# EasyEDA schematic SuperCapacitor2.0_2020-03-19_00-01-51.json

## Sheets
1 Switch1 copy: TITLE: SC8701; REV: 1.0; Date: 2020-02-22; Sheet: 1/1; Drawn By: Bard; Company: Your Company
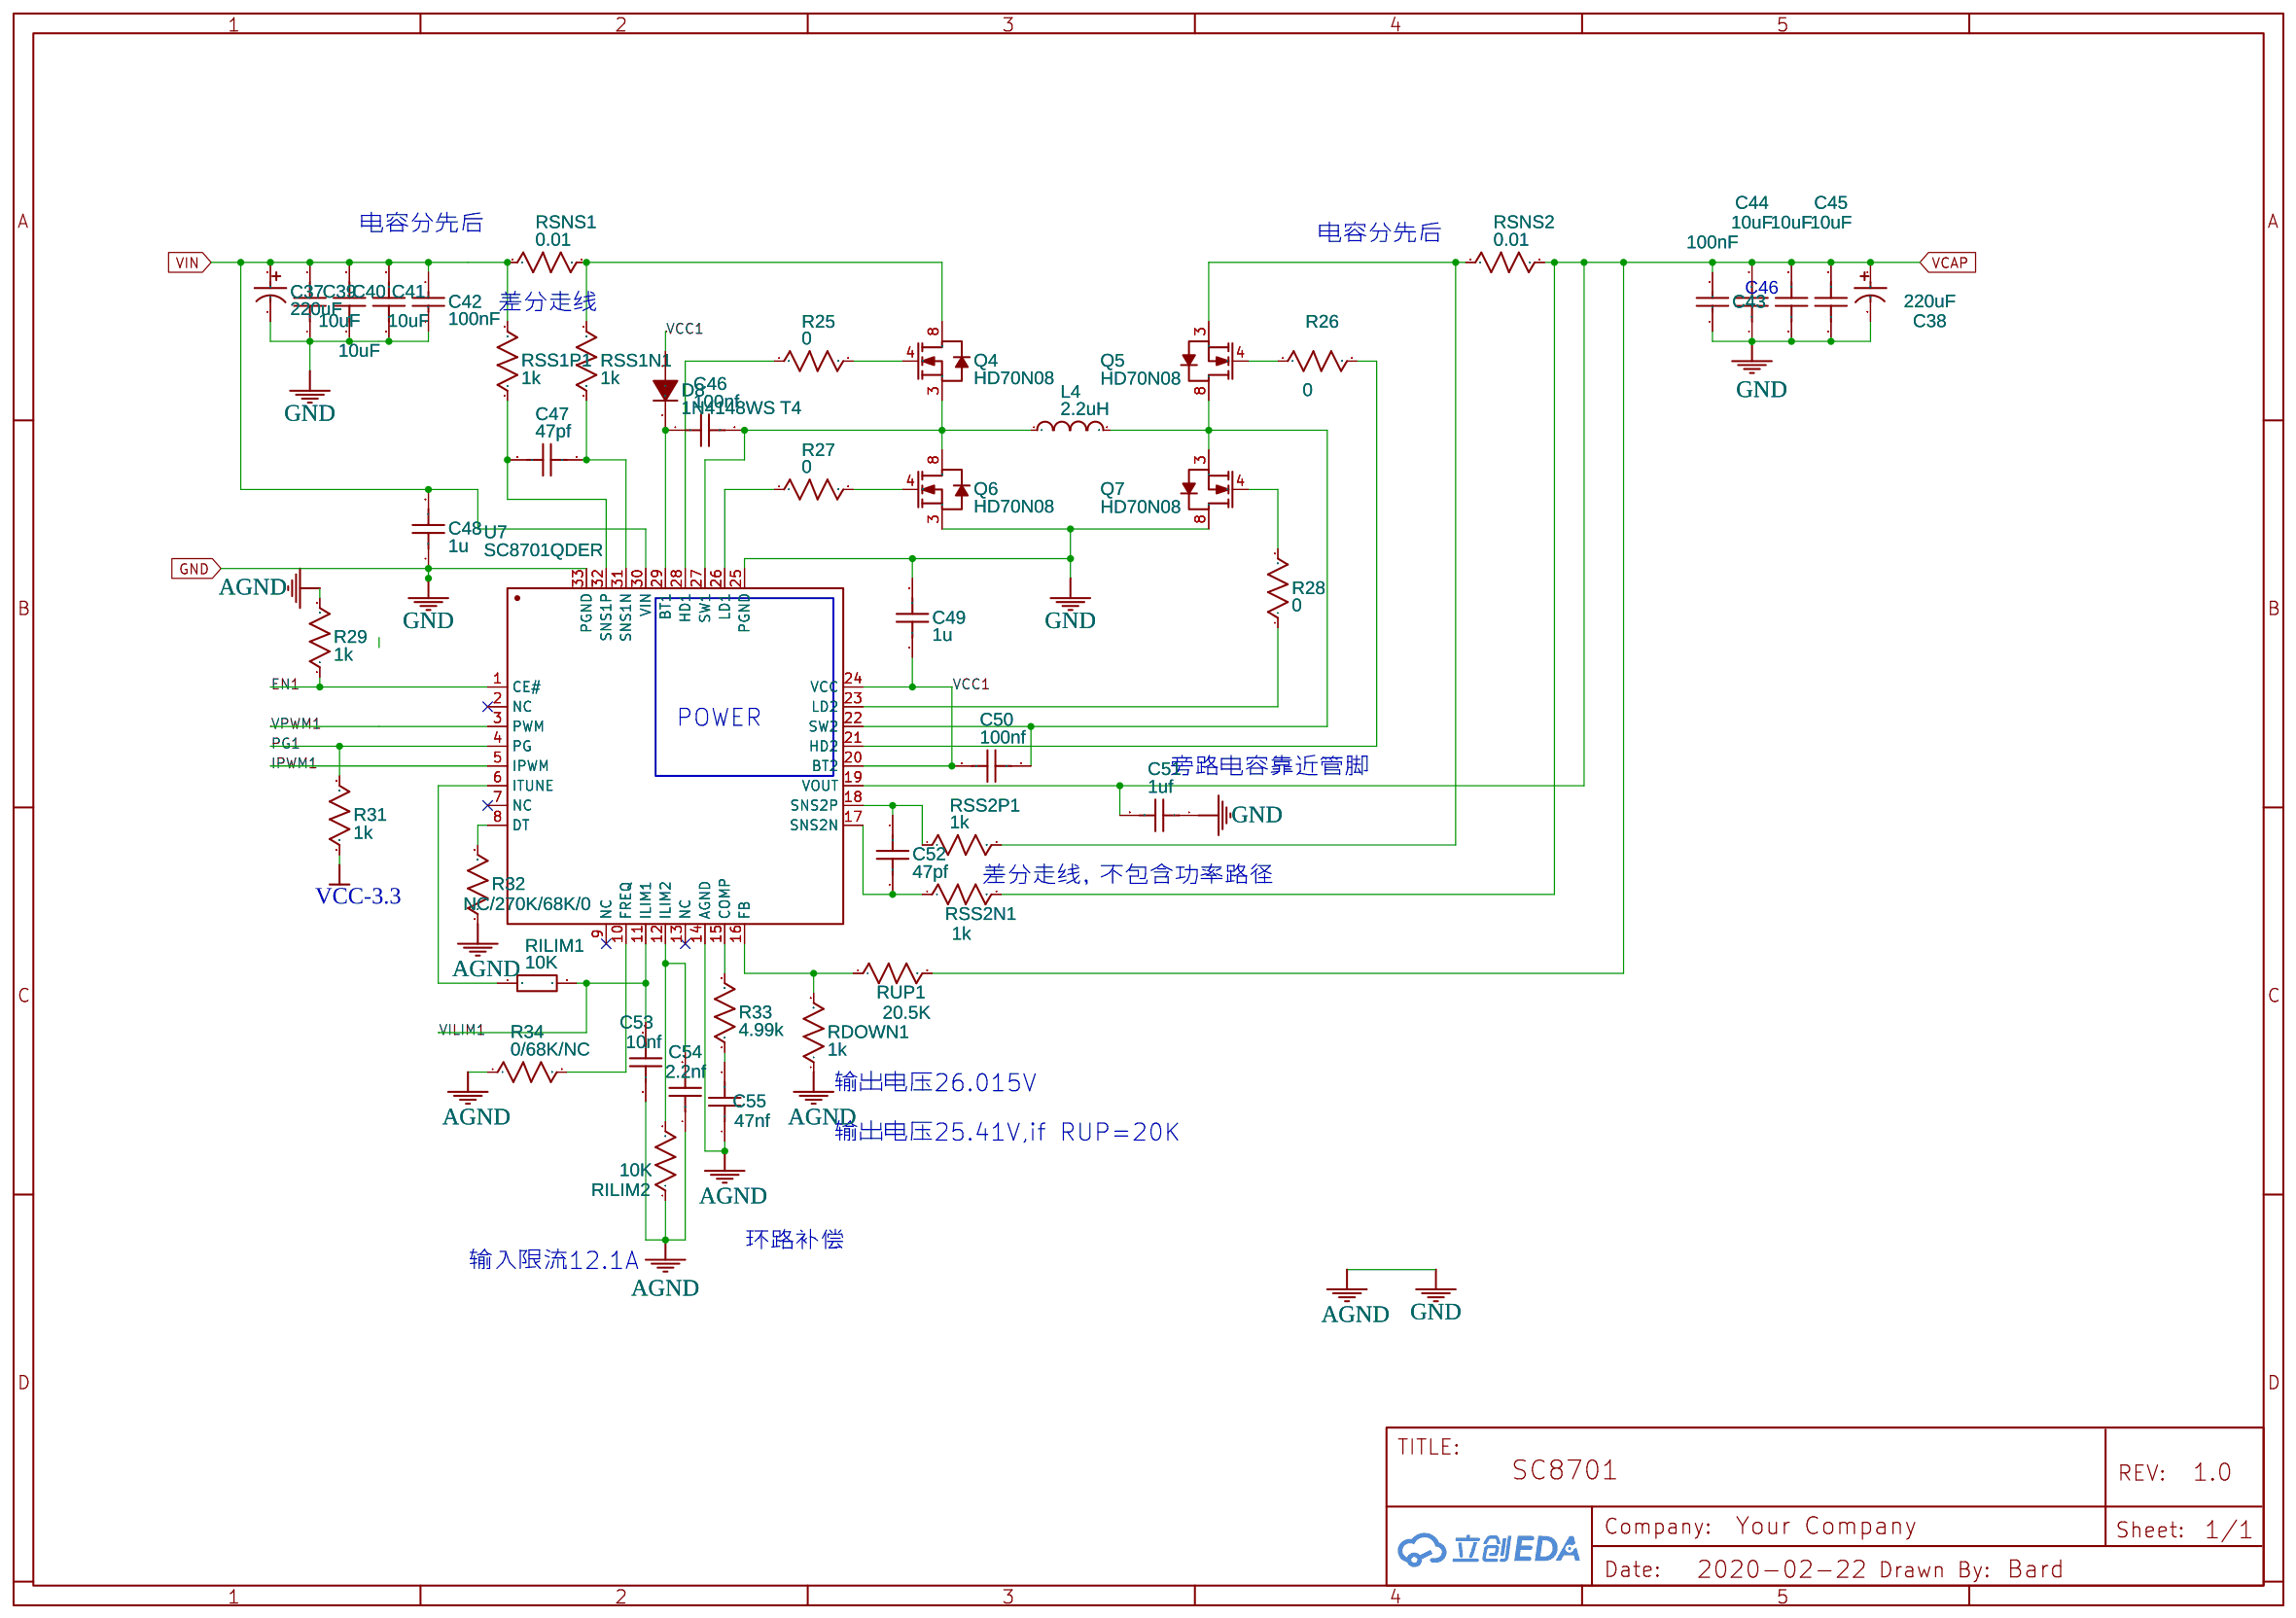
[diagram p0: Switch1 copy]
2 Switch2 copy: TITLE: Sheet_1
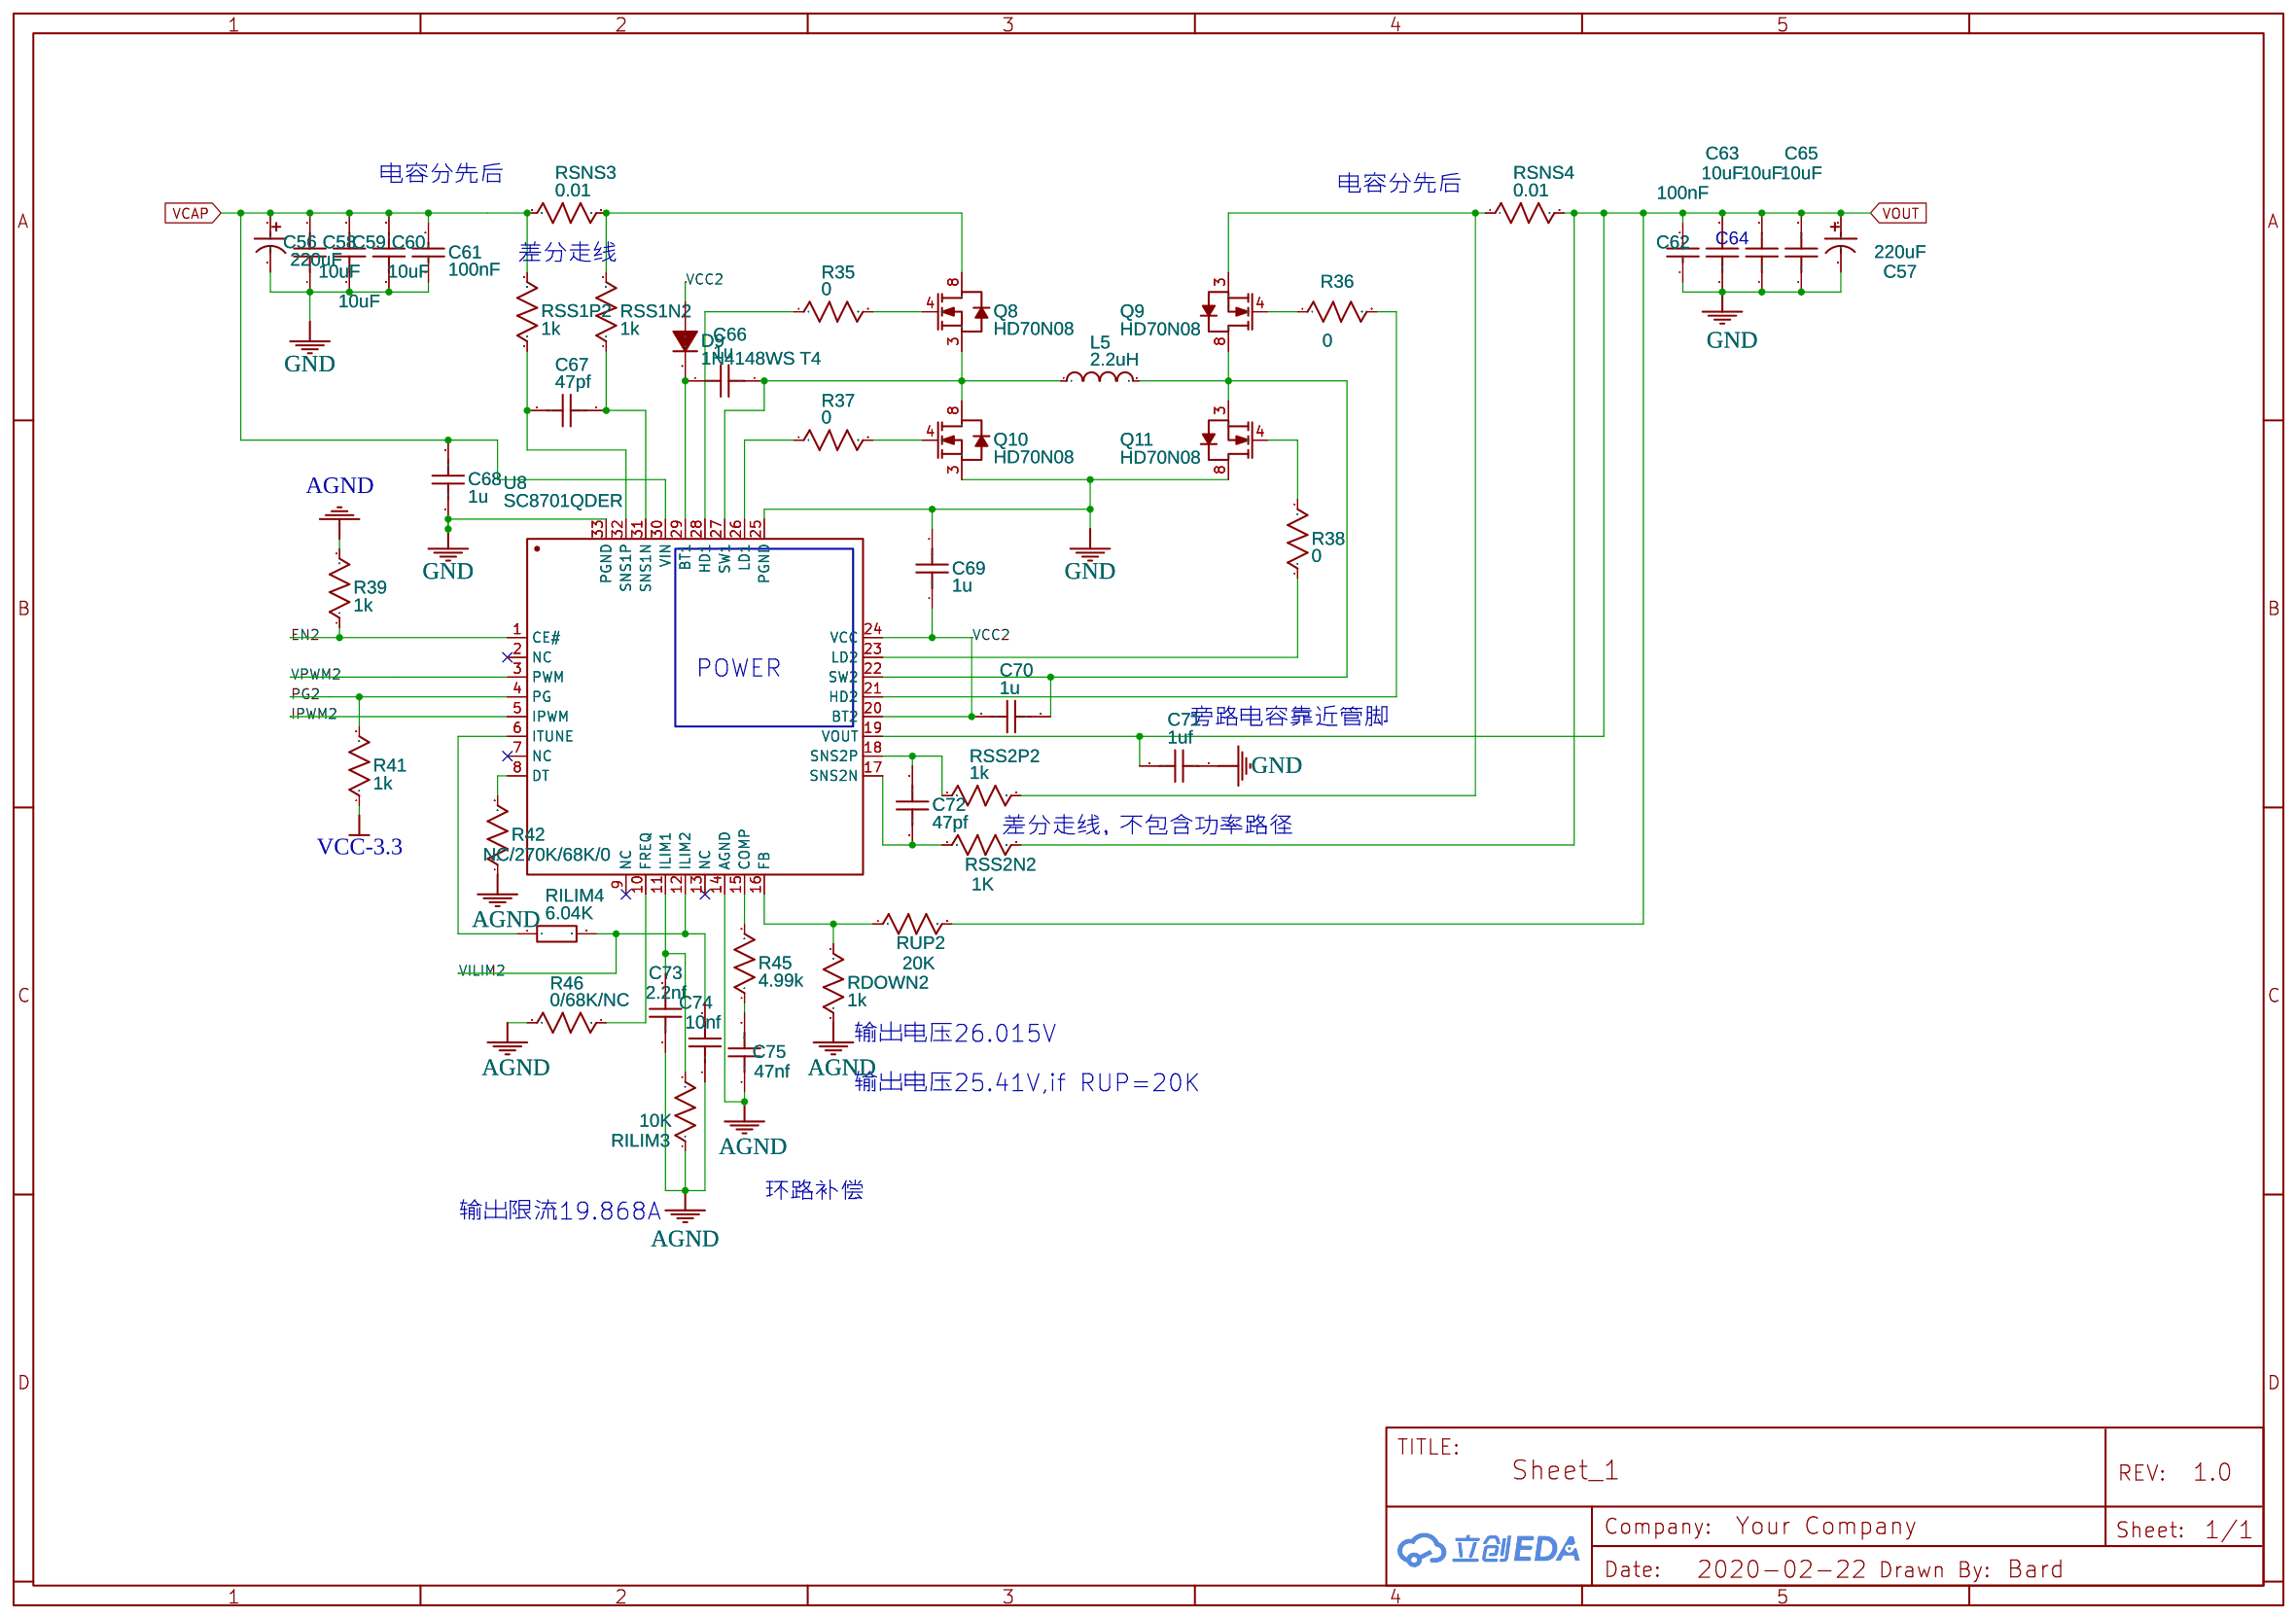
[diagram p1: Switch2 copy]
3 MCU copy: TITLE: Sheet_1
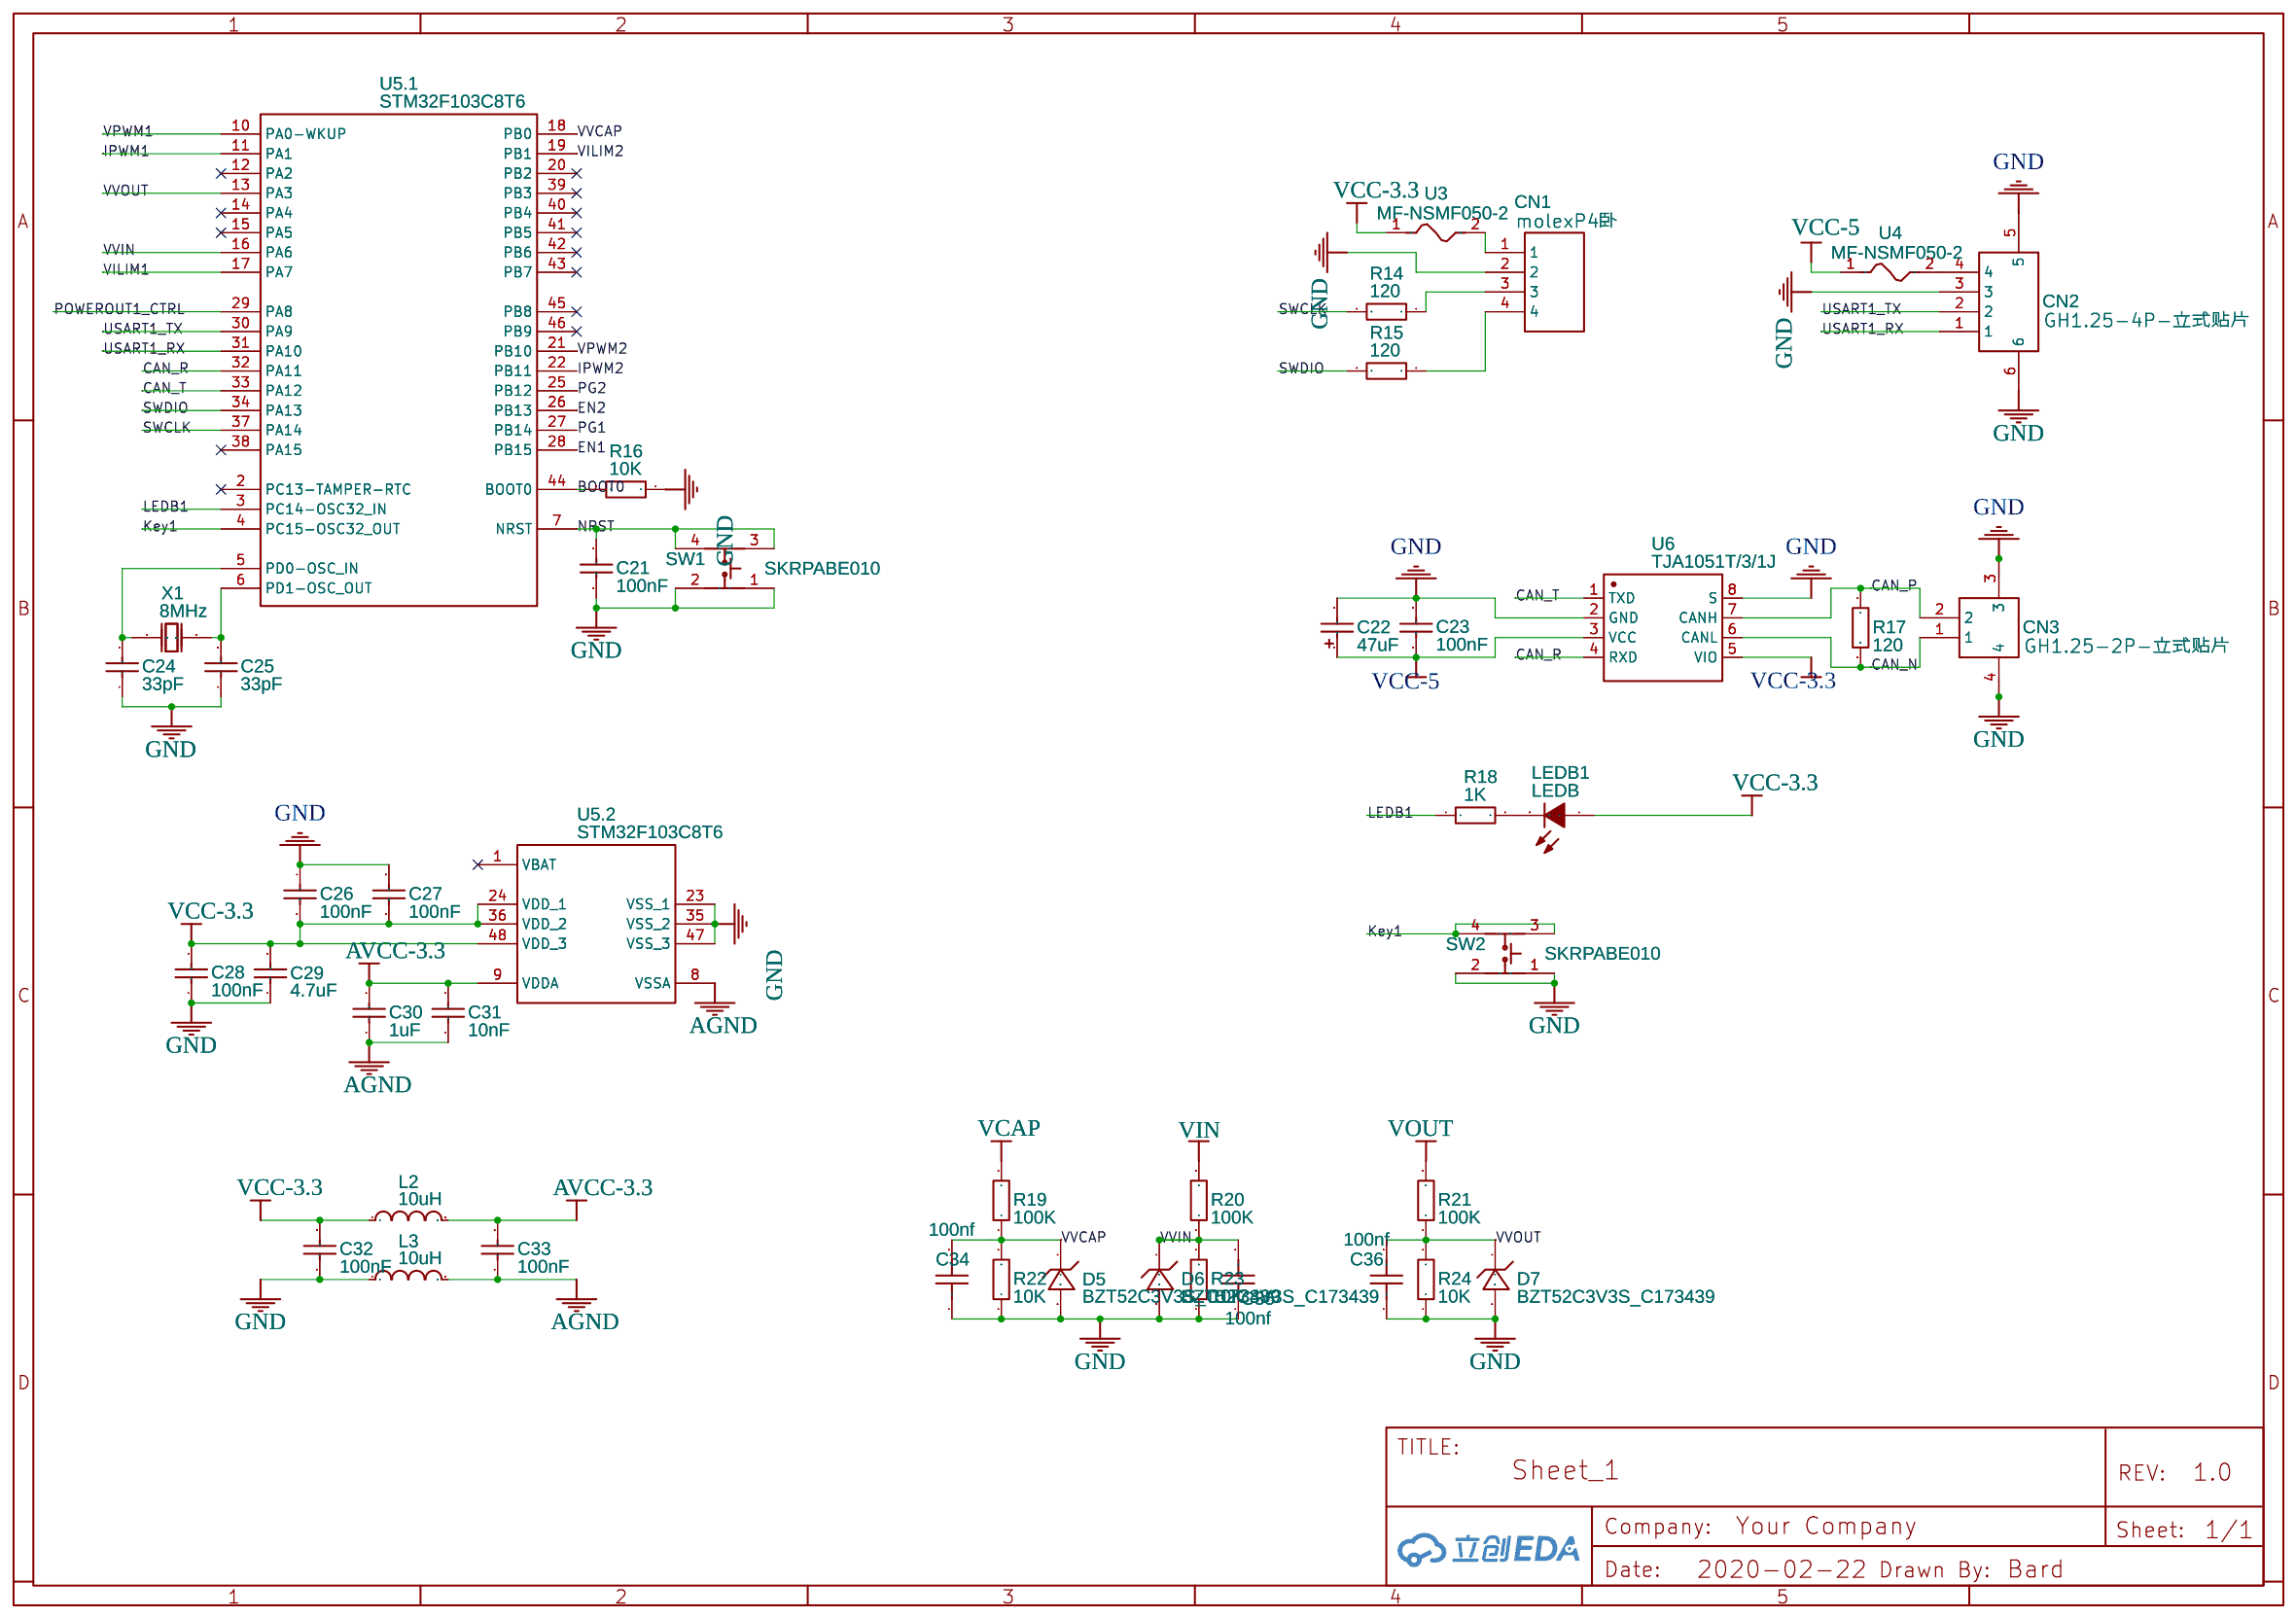
[diagram p2: MCU copy]
4 Connection copy: TITLE: Sheet_1; Date: 2020-02-23
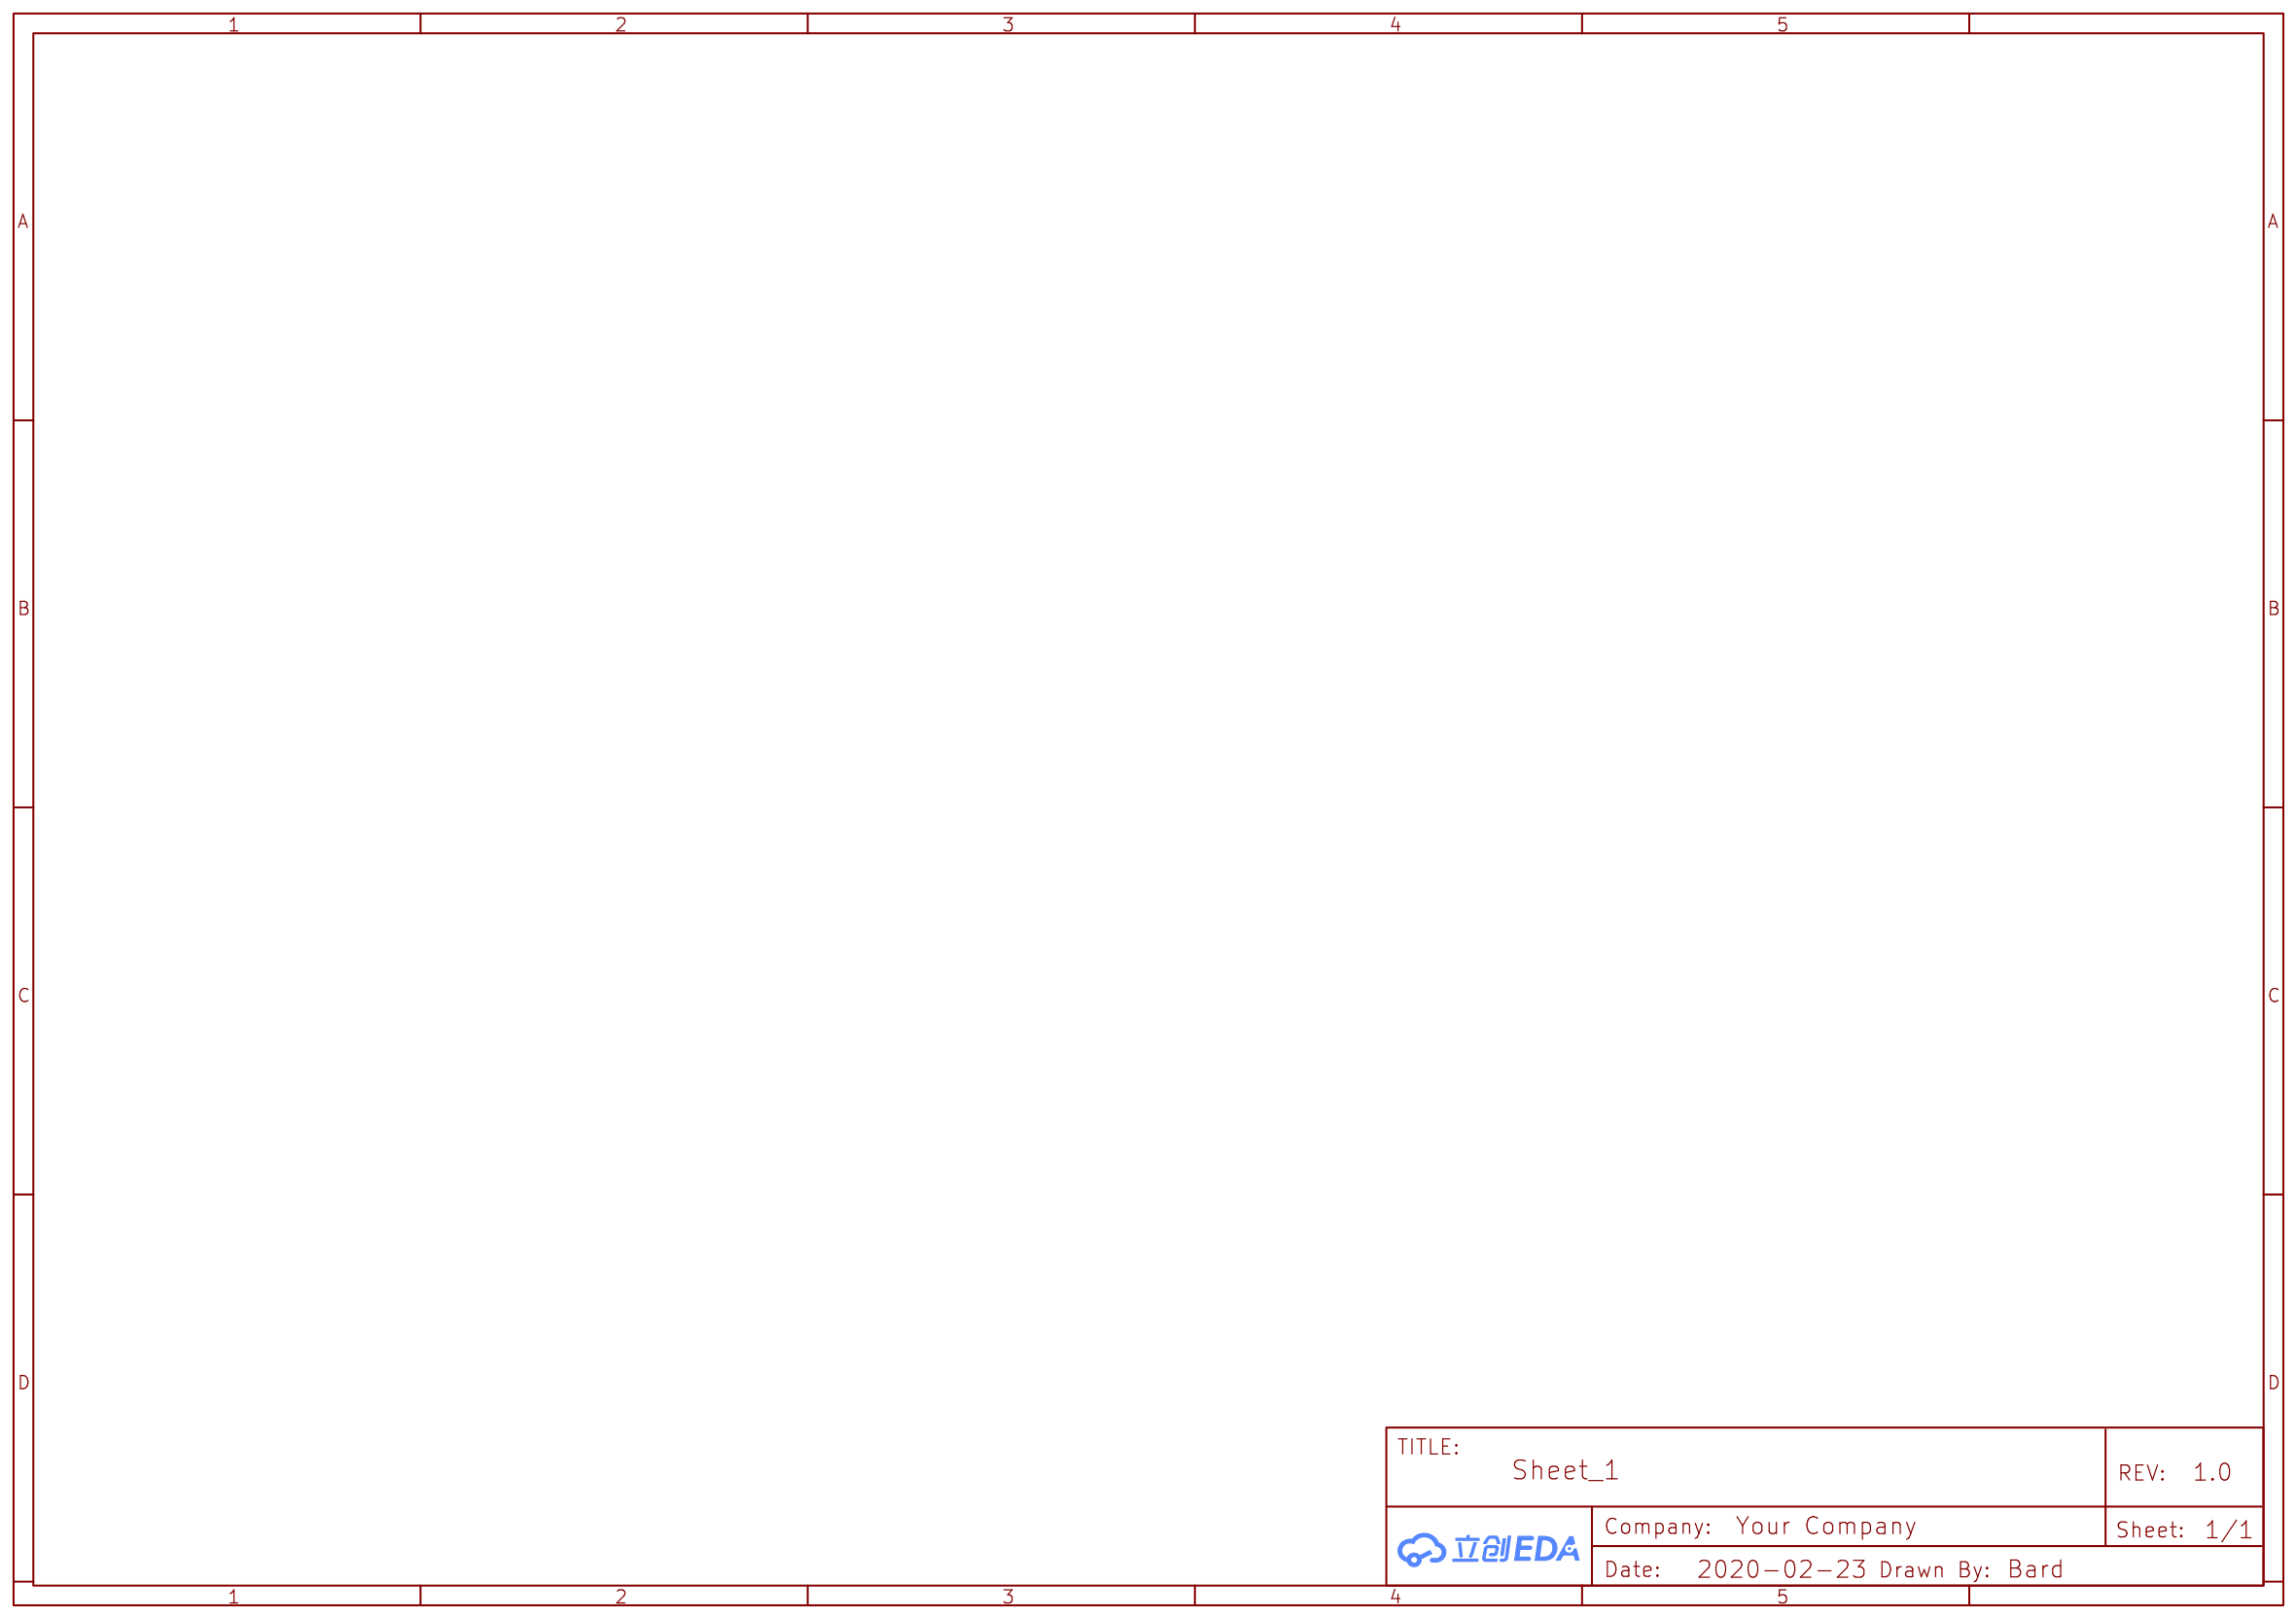
[diagram p3: Connection copy]
5 Main copy
6 power copy: TITLE: Sheet_1; Date: 2020-02-25
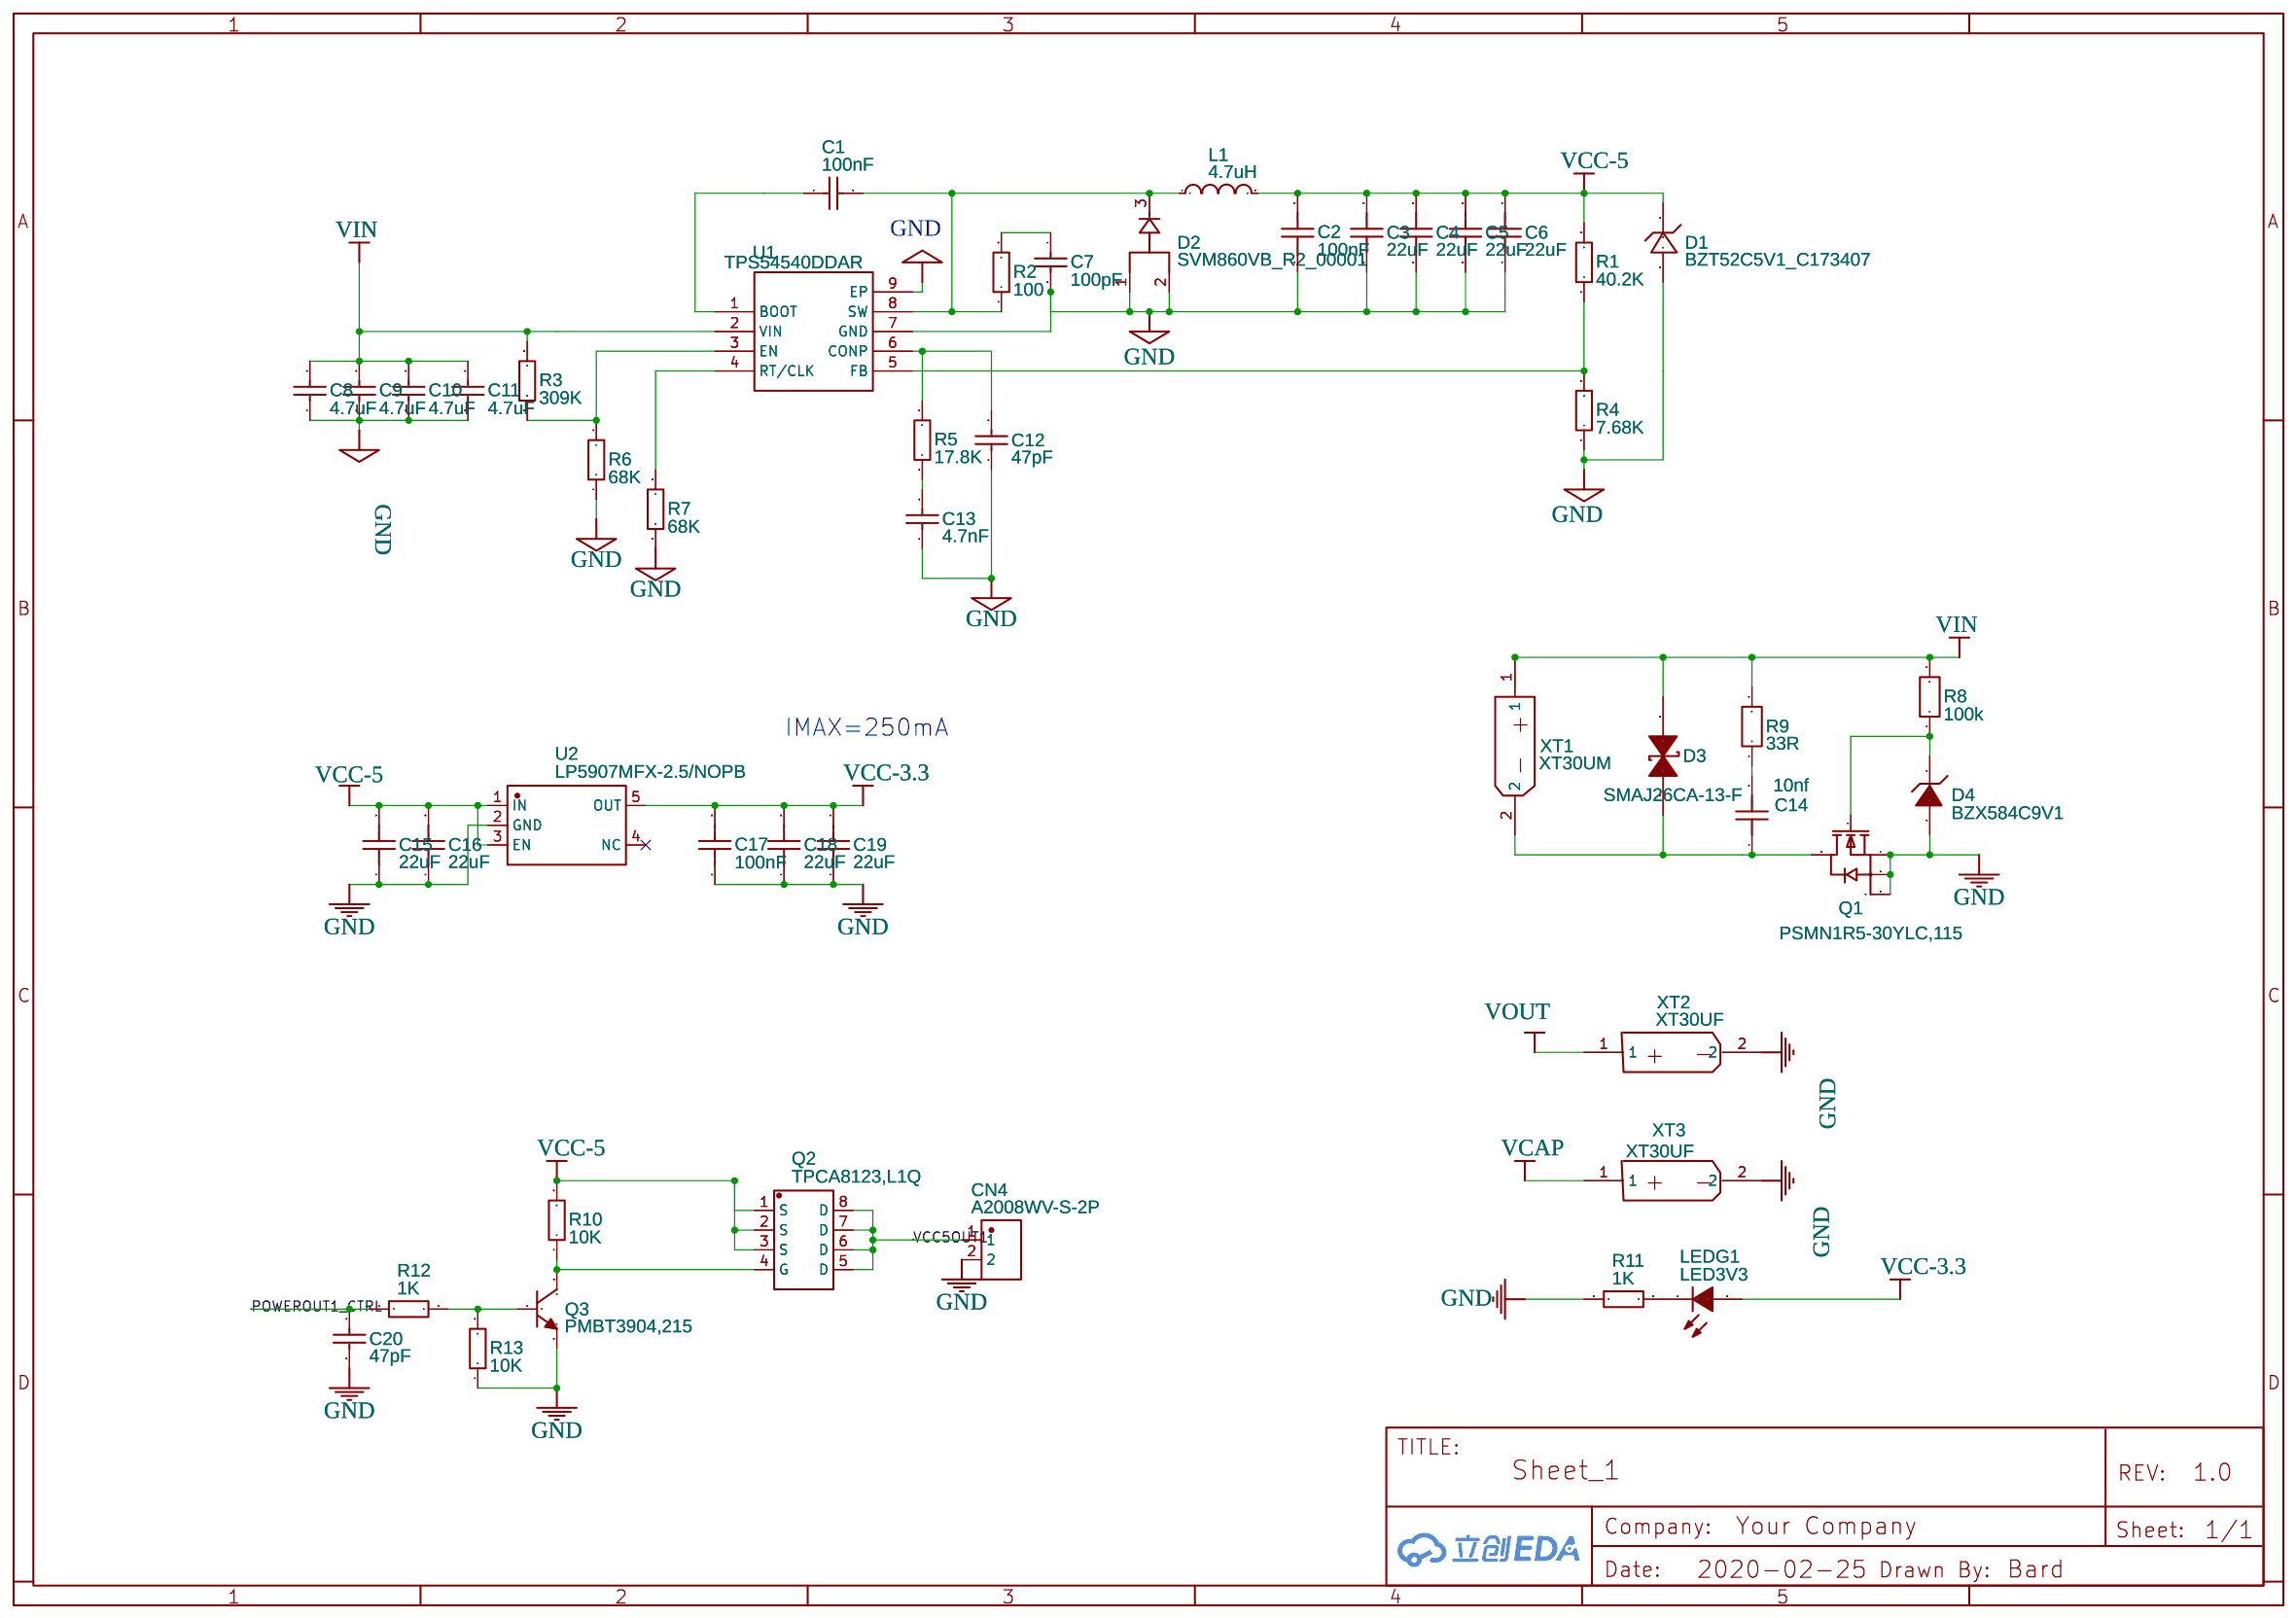
[diagram p4: power copy]

## Parts
sheet MCU copy
C21  100nF  [C0603]
C22  47uF  [CASE-A_3216]
C23  100nF  [R0603]
C24  33pF  [C0603]
C25  33pF  [C0603]
C26  100nF  [C0603]
C27  100nF  [C0603]
C28  100nF  [C0603]
C29  4.7uF  [C0603]
C30  1uF  [C0603]
C31  10nF  [C0603]
C32  100nF  [C0603]
C33  100nF  [C0603]
C34  100nf  [C0603]
C35  100nf  [C0603]
C36  100nf  [C0603]
CN1  molexP4卧  [SMD-10.15X4.8-4P]
CN2  GH1.25-4P-立式贴片  [SMD-1.25MM-4P-JST-H4.05]
CN3  GH1.25-2P-立式贴片  [SMD-1.25MM-2P-JST-H4.05]
D5  BZT52C3V3S_C173439  [SOD-323_L1.8-W1.3-LS2.5-RD]
D6  BZT52C3V3S_C173439  [SOD-323_L1.8-W1.3-LS2.5-RD]
D7  BZT52C3V3S_C173439  [SOD-323_L1.8-W1.3-LS2.5-RD]
L2  10uH  [L0603]
L3  10uH  [L0603]
LEDB1  LEDB  [LED-0603]
R14  120  [R0402]
R15  120  [R0402]
R16  10K  [R0402]
R17  120  [R0402]
R18  1K  [R0603]
R19  100K  [R0402]
R20  100K  [R0402]
R21  100K  [R0402]
R22  10K  [R0402]
R23  10K  [R0402]
R24  10K  [R0402]
SW1  SKRPABE010  [KEY-SMD-4P_L4.2-W3.2-H2.5]
SW2  SKRPABE010  [KEY-SMD-4P_L4.2-W3.2-H2.5]
U3  MF-NSMF050-2  [FUSE-1206]
U4  MF-NSMF050-2  [FUSE-1206]
U5  STM32F103C8T6  [LQFP-48_7X7X05P]  (sections 1,2)
U6  TJA1051T/3/1J  [SOIC-8_150MIL]
X1  8MHz  [SMD-5032_2P]
sheet power copy
C1  100nF  [C0603]
C2  100nF  [C0603]
C3  22uF  [C0603]
C4  22uF  [C0603]
C5  22uF  [C0603]
C6  22uF  [C0603]
C7  100pF  [C0603]
C8  4.7uF  [C0805]
C9  4.7uF  [C0805]
C10  4.7uF  [C0805]
C11  4.7uF  [C0805]
C12  47pF  [C0402]
C13  4.7nF  [C0402]
C14  10nf  [C0603]
C15  22uF  [C0603]
C16  22uF  [C0603]
C17  100nF  [C0402]
C18  22uF  [C0603]
C19  22uF  [C0603]
C20  47pF  [C0402]
CN4  A2008WV-S-2P  [CONN-SMD_A2008WV-S-2P]
D1  BZT52C5V1_C173407  [SOD-123_L2.7-W1.6-LS3.7-RD]
D2  SVM860VB_R2_00001  [TO-277B_3P-L6.1-W4.3-LS7.0-BR]
D3  SMAJ26CA-13-F  [SMA_L4.4-W2.6-LS5.0-BI]
D4  BZX584C9V1  [SOD-523F_L1.7-W0.9-LS1.7-RD]
L1  4.7uH  [IND-SMD_L6.0-W6.0]
LEDG1  LED3V3  [LED-0603]
Q1  PSMN1R5-30YLC,115  [SOT-669_L4.9-W4.0-P1.27-LS6.0-BR]
Q2  TPCA8123,L1Q  [POWERVDFN-8_L6.0-W5.0-P1.27-BL]
Q3  PMBT3904,215  [SOT-23_L2.9-W1.3-P0.95-LS2.4-BR]
R1  40.2K  [R0603]
R2  100  [R0402]
R3  309K  [R0603]
R4  7.68K  [R0402]
R5  17.8K  [R0603]
R6  68K  [R0603]
R7  68K  [R0603]
R8  100k  [R0603]
R9  33R  [R0603]
R10  10K  [R0402]
R11  1K  [R0603]
R12  1K  [R0402]
R13  10K  [R0402]
U1  TPS54540DDAR  [SOIC-8_L4.9-W3.9-P1.27-LS6.0-BL-EP]
U2  LP5907MFX-2.5/NOPB  [SOT-23-5_L3.0-W1.7-P0.95-LS2.8-BL]
XT1  XT30UM  [CONN-TH_XT30UPB-F]
XT2  XT30UF  [CONN-TH_XT30UPB-F]
XT3  XT30UF  [CONN-TH_XT30UPB-F]
sheet Switch1 copy
C37  220uF  [CAP-SMD_BD10.0-L10.3-W10.3-FD]
C38  220uF  [CAP-SMD_BD10.0-L10.3-W10.3-FD]
C39  10uF  [C1206]
C40  10uF  [C1206]
C41  10uF  [C1206]
C42  100nF  [C0603]
C43  100nF  [C0603]
C44  10uF  [C1206]
C45  10uF  [C1206]
C46  100nf  [C0402]
C47  47pf  [C0402]
C48  1u  [C0402]
C49  1u  [C0402]
C50  100nf  [C0402]
C51  1uf  [C0402]
C52  47pf  [C0402]
C53  10nf  [C0402]
C54  2.2nf  [C0402]
C55  47nf  [C0402]
D8  1N4148WS T4  [SOD-323_L1.8-W1.3-LS2.5-FD]
L4  2.2uH  [IND-SMD_L17.5-W17.0_YXMAC1770]
NO1  10uF  [C1206]
Q4  HD70N08  [PDFN-8_L4.9-W5.8-P1.27-LS6.1-BL FOR3]
Q5  HD70N08  [PDFN-8_L4.9-W5.8-P1.27-LS6.1-BL FOR3]
Q6  HD70N08  [PDFN-8_L4.9-W5.8-P1.27-LS6.1-BL FOR3]
Q7  HD70N08  [PDFN-8_L4.9-W5.8-P1.27-LS6.1-BL FOR3]
R25  0  [R0603]
R26  0  [R0603]
R27  0  [R0603]
R28  0  [R0603]
R29  1k  [R0402]
R31  1k  [R0402]
R32  NC/270K/68K/0  [R0402]
R33  4.99k  [R0402]
R34  0/68K/NC  [R0402]
RDOWN1  1k  [R0402]
RILIM1  10K  [R0402]
RILIM2  10K  [R0402]
RSNS1  0.01  [R0805]
RSNS2  0.01  [R0805]
RSS1N1  1k  [R0402]
RSS1P1  1k  [R0402]
RSS2N1  1k  [R0402]
RSS2P1  1k  [R0402]
RUP1  20.5K  [R0402]
U7  SC8701QDER  [QFN-32_L4.0-W4.0-P0.4-BL-EP2.6]
sheet Switch2 copy
C56  220uF  [CAP-SMD_BD10.0-L10.3-W10.3-FD]
C57  220uF  [CAP-SMD_BD10.0-L10.3-W10.3-FD]
C58  10uF  [C1206]
C59  10uF  [C1206]
C60  10uF  [C1206]
C61  100nF  [C0603]
C62  100nF  [C0603]
C63  10uF  [C1206]
C64  10uF  [C1206]
C65  10uF  [C1206]
C66  1u  [C0402]
C67  47pf  [C0402]
C68  1u  [C0402]
C69  1u  [C0402]
C70  1u  [C0402]
C71  1uf  [C0402]
C72  47pf  [C0402]
C73  2.2nf  [C0402]
C74  10nf  [C0402]
C75  47nf  [C0402]
D9  1N4148WS T4  [SOD-323_L1.8-W1.3-LS2.5-FD]
L5  2.2uH  [IND-SMD_L17.5-W17.0_YXMAC1770]
Q8  HD70N08  [PDFN-8_L4.9-W5.8-P1.27-LS6.1-BL FOR3]
Q9  HD70N08  [PDFN-8_L4.9-W5.8-P1.27-LS6.1-BL FOR3]
Q10  HD70N08  [PDFN-8_L4.9-W5.8-P1.27-LS6.1-BL FOR3]
Q11  HD70N08  [PDFN-8_L4.9-W5.8-P1.27-LS6.1-BL FOR3]
R35  0  [R0603]
R36  0  [R0603]
R37  0  [R0603]
R38  0  [R0603]
R39  1k  [R0402]
R41  1k  [R0402]
R42  NC/270K/68K/0  [R0402]
R45  4.99k  [R0402]
R46  0/68K/NC  [R0402]
RDOWN2  1k  [R0402]
RILIM3  10K  [R0402]
RILIM4  6.04K  [R0402]
RSNS3  0.01  [R0805]
RSNS4  0.01  [R0805]
RSS1N2  1k  [R0402]
RSS1P2  1k  [R0402]
RSS2N2  1K  [R0402]
RSS2P2  1k  [R0402]
RUP2  20K  [R0402]
U8  SC8701QDER  [QFN-32_L4.0-W4.0-P0.4-BL-EP2.6]

## Library data of the parts
C1 C21 C23 C26-C28 C32 C33 = CL05B104KO5NNNC: Supplier: LCSC; Manufacturer: SAMSUNG; LCSC Assembly: Yes; Supplier Part: C1525
C22 = CA45-A010K476T: Supplier: LCSC; Manufacturer: Xiangyee; Contributor: LCSC; Supplier Part: C127069; LCSC Assembly: Yes
C24 C25 = CL05C330JB5NNNC: Supplier: LCSC; Manufacturer: SAMSUNG; Supplier Part: C70465
C29 = CL10A475KO8NNNC: Supplier: LCSC; Manufacturer: SAMSUNG; LCSC Assembly: Yes; Supplier Part: C19666; SMT Type: Basic
C30 = CL10A105KB8NNNC: Supplier: LCSC; Manufacturer: SAMSUNG; LCSC Assembly: Yes; Supplier Part: C15849
C31 = CL05B103KB5NNNC: Supplier: LCSC; Manufacturer: SAMSUNG; LCSC Assembly: Yes; Supplier Part: C15195
C14 C34-C36 C46 C48-C51 C53-C55 C66-C75 = Cap_0402_US
CN1 = -: Supplier: LCSC; Manufacturer: MOLEX; Manufacturer Part: 532610471; Supplier Part: C127368
CN2 = -: Supplier: LCSC; Supplier Part: C161692; Manufacturer: JST Sales America; Manufacturer Part: BM04B-GHS-TBT(LF)(SN); Contributor: LCSC
CN3 = -: Supplier: LCSC; Supplier Part: C161690; Manufacturer: JST Sales America; Manufacturer Part: BM02B-GHS-TBT (LF)(SN); Contributor: LCSC
D5-D7 = BZT52C3V3S_C173439: Supplier: LCSC; Supplier Part: C173439; Manufacturer: (MDD) Jiangsu Yutai Elec; Manufacturer Part: BZT52C3V3S; Contributor: LCSC; LCSC Assembly: Yes; SMT Type: Extend
L2 L3 = SDFL2012S100KTF: Supplier: LCSC; Manufacturer: Sunlord; LCSC Assembly: Yes; Supplier Part: C1046; SMT Type: Basic
LEDB1 = -: Supplier: LCSC; Manufacturer: EVERLIGHT; LCSC Assembly: Yes; Supplier Part: C72041
R14 R15 R17 = 0402WGF1200TCE: Supplier: LCSC; Manufacturer: UniOhm; LCSC Assembly: Yes; Supplier Part: C25079
R10 R13 R16 R22-R24 = 0402WGF1002TCE: Supplier: LCSC; Manufacturer: UniOhm; LCSC Assembly: Yes; Supplier Part: C25744; SMT Type: Basic
R11 R12 R18 = 0402WGF1001TCE: Supplier: LCSC; Manufacturer: UniOhm; LCSC Assembly: Yes; Supplier Part: C11702; SMT Type: Basic
R19-R21 = 0402WGF1003TCE: Supplier: LCSC; Manufacturer: UniOhm; LCSC Assembly: Yes; Supplier Part: C25741; SMT Type: Basic
SW1 SW2 = -: Supplier: LCSC; Manufacturer: ALPS; Supplier Part: C115360
U3 U4 = -: Supplier: LCSC; Manufacturer: BOURNS; Supplier Part: C75464; LCSC Assembly: Yes
U5 = -: tags: STM32; Supplier Part: C8734; Supplier: LCSC; Manufacturer: ST; subpart_no: 1; image: http://image.lceda.cn/szlcsc/C8734.jpg
U6 = -: Supplier: LCSC; Manufacturer: NXP; LCSC Assembly: Yes; image: //image.lceda.cn/szlcsc/C38695.jpg; Supplier Part: C38695
X1 = X50328MSD2GC_C172361: Supplier: LCSC; Supplier Part: C172361; Manufacturer: Yangxing Tech; Manufacturer Part: X50328MSD2GC; Contributor: LCSC; LCSC Assembly: Yes
C2 = AC0603KRX7R0BB104: Supplier: LCSC; Supplier Part: C408909; Manufacturer: YAGEO; Contributor: LCSC
C3-C6 C15 C16 C18 C19 = CL10A226MQ8NRNC: Supplier: LCSC; Manufacturer: SAMSUNG; LCSC Assembly: Yes; Supplier Part: C59461; SMT Type: Basic
C7 = CGA3E2C0G1H101JT0Y0N: Supplier: LCSC; Manufacturer: TDK; Supplier Part: C76709
C8-C11 = CL21A475KBQNNNE: Supplier: LCSC; Manufacturer: SAMSUNG; Supplier Part: C98192
C12 C20 = 0402CG470J500NT: Supplier: LCSC; Manufacturer: FH; LCSC Assembly: Yes; Supplier Part: C1567; SMT Type: Basic
C13 = 0402B472K500NT: Supplier: LCSC; Manufacturer: FH; LCSC Assembly: Yes; Supplier Part: C1538; SMT Type: Basic
C17 = GRM188R71H104KA93D: Supplier: LCSC; Manufacturer: MuRata; Supplier Part: C77055
CN4 = A2008WV-S-2P: Supplier: LCSC; Supplier Part: C273123; Manufacturer: Changjiang Connectors; Contributor: LCSC
D1 = BZT52C5V1_C173407: Supplier: LCSC; Supplier Part: C173407; Manufacturer: (MDD) Jiangsu Yutai Elec; Manufacturer Part: BZT52C5V1; Contributor: LCSC; LCSC Assembly: Yes; SMT Type: Extend
D2 = SVM860VB_R2_00001: Supplier: LCSC; Supplier Part: C391734; Manufacturer: PANJIT International; Contributor: LCSC
D3 = SMAJ26CA-13-F: Supplier: LCSC; Manufacturer: DIODES; Contributor: LCSC; Supplier Part: C134976; LCSC Assembly: Yes; SMT Type: Extend
D4 = BZX584C12-V-G-08: Supplier: LCSC; LCSC Assembly: Yes; SMT Type: Extend
L1 = SMNR6028-4R7MT: Supplier: LCSC; Supplier Part: C266428; Manufacturer: ShunXiang Connaught Elec; Contributor: LCSC
LEDG1 = -: Supplier: LCSC; Manufacturer: EVERLIGHT; Manufacturer Part: 19-217/GHC-YR1S2/3T; LCSC Assembly: Yes; image: //image.lceda.cn/szlcsc/C72043.jpg; Supplier Part: C72043
Q1 = PSMN1R5-30YLC,115: Supplier: LCSC; Supplier Part: C427523; Manufacturer: Nexperia; Contributor: LCSC
Q2 = TPCA8123,L1Q: Supplier: LCSC; Supplier Part: C180399; Manufacturer: TOSHIBA; Contributor: LCSC; LCSC Assembly: Yes; SMT Type: Extend
Q3 = PMBT3904,215: Supplier: LCSC; Manufacturer: Nexperia; image: //image.lceda.cn/szlcsc/C8667.jpg; Supplier Part: C8667; LCSC Assembly: Yes; SMT Type: Extend
R1 = 0603WAF4022T5E: Supplier: LCSC; Manufacturer: UniOhm; LCSC Assembly: Yes; Supplier Part: C12447; SMT Type: Basic
R2 = AC0402FR-07100RL: Supplier: LCSC; Supplier Part: C144808; Manufacturer: YAGEO; Contributor: LCSC
R3 = 0603WAF3093T5E: Supplier: LCSC; Manufacturer: UniOhm; Supplier Part: C23001; LCSC Assembly: Yes; SMT Type: Extend
R4 = 0402WGF7681TCE: Supplier: LCSC; Manufacturer: UniOhm; Supplier Part: C25919; LCSC Assembly: Yes; SMT Type: Extend
R5 = 0603WAF1782T5E: Supplier: LCSC; Manufacturer: UniOhm; Supplier Part: C22821; LCSC Assembly: Yes; SMT Type: Extend
R6 R7 = 0603WAF6802T5E: Supplier: LCSC; Manufacturer: UniOhm; LCSC Assembly: Yes; Supplier Part: C23231; SMT Type: Basic
R8 R9 = Res_AXIAL-0.3(1/8W)_EU
U1 = TPS54540DDAR: Supplier: LCSC; Manufacturer: TI; Supplier Part: C95286; LCSC Assembly: Yes; SMT Type: Extend
U2 = LP5907MFX-2.5/NOPB: Supplier: LCSC; Manufacturer: TI; Contributor: LCSC; Supplier Part: C165132; LCSC Assembly: Yes; SMT Type: Extend
XT1-XT3 = -: Manufacturer Part: XT60; Contributor: 4bucks; Package Display: No
C37 C38 C56 C57 = DV221M050G105A: Supplier: LCSC; Manufacturer: CapXon; Supplier Part: C65217
C39-C41 C44 C45 C58-C60 C63-C65 NO1 = GRM31CR61H106KA12L: Supplier: LCSC; Manufacturer: MuRata; Supplier Part: C77092
C42 C43 C61 C62 = CL10B104JB8NNNC: Supplier: LCSC; Manufacturer: SAMSUNG; Supplier Part: C1525; LCSC Assembly: Yes; SMT Type: Extend
C47 C52 = Cap_0402_US: Supplier Part: C1567
D8 D9 = 1N4148WS T4: Supplier: LCSC; Manufacturer: CJ; LCSC Assembly: Yes; image: //image.lceda.cn/szlcsc/C2128.jpg; Supplier Part: C2128; SMT Type: Basic
L4 L5 = YXMAC1770-2R2M-IGP: Supplier: LCSC; Supplier Part: C241452; Manufacturer: YUXIN TECH; Contributor: LCSC
Q4 = HD70N08: Supplier: LCSC; Supplier Part: C190849; Manufacturer: HL; Contributor: LCSC
Q5-Q11 = HD70N08: Supplier: LCSC; Supplier Part: C216254; Manufacturer: HL; Contributor: LCSC
R25-R29 R31-R39 R41 R42 R45 R46 RDOWN1 RDOWN2 RILIM2 RILIM3 RUP1 RUP2 = Res_0402(1/16W)_US
RILIM1 = 0805WAD1002T5E: Supplier: LCSC; Supplier Part: C25744; Contributor: LCSC; LCSC Assembly: Yes
RSNS1-RSNS4 = Res_0402(1/16W)_US: Supplier Part: C236284
RSS1N1 RSS1N2 RSS1P1 RSS1P2 RSS2N1 RSS2N2 RSS2P1 RSS2P2 = Res_0402(1/16W)_US: Supplier Part: C319809
U7 U8 = SC8701QDER: Supplier: LCSC; Supplier Part: C252410; Manufacturer: Southchip Semicon; Contributor: LCSC; LCSC Assembly: Yes; SMT Type: Extend
RILIM4 = WR04X6041FTL: Supplier: LCSC; Manufacturer: WTC; Contributor: LCSC; Supplier Part: C168240

## Nets
AGND: C2.1 C3.1 C4.1 C5.1 C6.1 C7.2 C8.1 C9.1 C10.1 C11.1 C12.1 C13.1 C15.1 C16.1 C17.1 C18.1 C19.1 C20.1 C21.1 C22.2 C23.2 C24.1 C25.1 C26.1 C27.2 C28.1 C29.1 C30.1 C31.1 C32.1 C33.1 C34.1 C35.1 C36.1 C37.2 C38.2 C39.1 C40.1 C41.1 C42.1 C43.1 C44.1 C45.1 C48.1 C49.2 C51.1 C53.1 C54.1 C55.1 C56.2 C57.2 C58.1 C59.1 C60.1 C61.1 C62.1 C63.1 C64.1 C65.1 C68.1 C69.2 C71.1 C73.1 C74.1 C75.1 CN1.2 CN2.3 CN2.5 CN2.6 CN3.3 CN3.4 CN4.2 D1.2(A) D2.1 D2.2 D4.2(A) D5.2 D6.2 D7.2 L3.1 L3.2 NO1.1 Q1.1(S) Q1.2(S) Q1.3(S) Q3.2 Q6.3(S) Q7.8(D) Q10.3(S) Q11.8(D) R4.1 R6.1 R7.1 R11.1 R13.1 R16.1 R22.1 R23.1 R24.1 R29.2 R32.1 R34.1 R39.2 R42.1 R46.1 RDOWN1.1 RDOWN2.1 RILIM2.1 RILIM3.1 SW1.1 SW1.2 SW2.1 SW2.2 U1.7(GND) U1.9(EP) U2.2(GND) U5.8(VSSA) U5.23(VSS_1) U5.35(VSS_2) U5.47(VSS_3) U6.2(GND) U6.8(S) U7.14(AGND) U7.25(PGND) U7.33(PGND) U8.14(AGND) U8.25(PGND) U8.33(PGND) XT2.2 XT3.2
AVCC-3.3: C30.2 C31.2 C33.2 L2.2 U5.9(VDDA)
VCC1: C49.1 C50.2 D8.1(A) U7.20(BT2) U7.24(VCC)
VCC2: C69.1 C70.2 D9.1(A) U8.20(BT2) U8.24(VCC)
VCC5OUT1: CN4.1 Q2.5(D) Q2.6(D) Q2.7(D) Q2.8(D)
VCC-3.3: C17.2 C18.2 C19.2 C26.2 C27.1 C28.2 C29.2 C32.2 L2.1 LEDB1.1(A) LEDG1.1(A) R31.1 R41.1 U2.5(OUT) U3.1 U5.24(VDD_1) U5.36(VDD_2) U5.48(VDD_3) U6.5(VIO)
VCC-5: C2.2 C3.2 C4.2 C5.2 C6.2 C15.2 C16.2 C22.1 C23.1 D1.1(C) L1.2 Q2.1(S) Q2.2(S) Q2.3(S) R1.2 R10.2 U2.1(IN) U2.3(EN) U4.1 U6.3(VCC)
VIN: C8.2 C9.2 C10.2 C11.2 C37.1 C39.2 C40.2 C41.2 C42.2 C48.2 D3.2 R3.2 R8.2 R9.2 R20.2 RSNS1.1 RSS1P1.2 U1.2(VIN) U7.30(VIN) XT1.1
BOOT0: R16.2 U5.44(BOOT0)
CAN_N: CN3.1 R17.2 U6.6(CANL)
CAN_P: CN3.2 R17.1 U6.7(CANH)
CAN_R: U5.32(PA11) U6.4(RXD)
CAN_T: U5.33(PA12) U6.1(TXD)
EN1: R29.1 U5.28(PB15) U7.1(CE#)
EN2: R39.1 U5.26(PB13) U8.1(CE#)
IPWM1: U5.11(PA1) U7.5(IPWM)
IPWM2: U5.22(PB11) U8.5(IPWM)
Key1: SW2.3 SW2.4 U5.4(PC15-OSC32_OUT)
LEDB1: R18.1 U5.3(PC14-OSC32_IN)
NRST: C21.2 SW1.3 SW1.4 U5.7(NRST)
PG1: R31.2 U5.27(PB14) U7.4(PG)
PG2: R41.2 U5.25(PB12) U8.4(PG)
POWEROUT1_CTRL: C20.2 R12.1 U5.29(PA8)
SWCLK: R14.2 U5.37(PA14)
SWDIO: R15.2 U5.34(PA13)
USART1_RX: CN2.1 U5.31(PA10)
USART1_TX: CN2.2 U5.30(PA9)
VCAP: C38.1 C43.2 C44.2 C45.2 C51.2 C56.1 C58.2 C59.2 C60.2 C61.2 C68.2 NO1.2 R19.2 RSNS2.2 RSNS3.1 RSS1P2.2 RSS2N1.2 RUP1.2 U7.19(VOUT) U8.30(VIN) XT3.1
VILIM1: C53.2 RILIM1.2 U5.17(PA7) U7.11(ILIM1)
VILIM2: C74.2 RILIM4.2 U5.19(PB1) U8.12(ILIM2)
VOUT: C57.1 C62.2 C63.2 C64.2 C65.2 C71.2 R21.2 RSNS4.2 RSS2N2.2 RUP2.2 U8.19(VOUT) XT2.1
VPWM1: U5.10(PA0-WKUP) U7.3(PWM)
VPWM2: U5.21(PB10) U8.3(PWM)
VVCAP: C34.2 D5.1 R19.1 R22.2 U5.18(PB0)
VVIN: C35.2 D6.1 R20.1 R23.2 U5.16(PA6)
VVOUT: C36.2 D7.1 R21.1 R24.2 U5.13(PA3)
Net-(C1-1): C1.1 U1.1(BOOT)
Net-(C1-2): C1.2 D2.3 L1.1 R2.1 U1.8(SW)
Net-(C7-1): C7.1 R2.2
Net-(C12-2): C12.2 R5.2 U1.6(CONP)
Net-(C13-2): C13.2 R5.1
Net-(C14-1): C14.1 D3.1 Q1.5(D) XT1.2
Net-(C14-2): C14.2 R9.1
Net-(C24-2): C24.2 U5.5(PD0-OSC_IN) X1.1(OSC1)
Net-(C25-2): C25.2 U5.6(PD1-OSC_OUT) X1.2(OSC2)
Net-(C46-1): C46.1 D8.2(K) U7.29(BT1)
Net-(C46-2): C46.2 L4.1 Q4.3(S) Q6.8(D) U7.27(SW1)
Net-(C47-1): C47.1 RSS1N1.1 U7.31(SNS1N)
Net-(C47-2): C47.2 RSS1P1.1 U7.32(SNS1P)
Net-(C50-1): C50.1 L4.2 Q5.8(D) Q7.3(S) U7.22(SW2)
Net-(C52-1): C52.1 RSS2P1.1 U7.18(SNS2P)
Net-(C52-2): C52.2 RSS2N1.1 U7.17(SNS2N)
Net-(C54-2): C54.2 RILIM2.2 U7.12(ILIM2)
Net-(C55-2): C55.2 R33.1
Net-(C66-1): C66.1 D9.2(K) U8.29(BT1)
Net-(C66-2): C66.2 L5.1 Q8.3(S) Q10.8(D) U8.27(SW1)
Net-(C67-1): C67.1 RSS1N2.1 U8.31(SNS1N)
Net-(C67-2): C67.2 RSS1P2.1 U8.32(SNS1P)
Net-(C70-1): C70.1 L5.2 Q9.8(D) Q11.3(S) U8.22(SW2)
Net-(C72-1): C72.1 RSS2P2.1 U8.18(SNS2P)
Net-(C72-2): C72.2 RSS2N2.1 U8.17(SNS2N)
Net-(C73-2): C73.2 RILIM3.2 U8.11(ILIM1)
Net-(C75-2): C75.2 R45.1
Net-(CN1-1): CN1.1 U3.2
Net-(CN1-3): CN1.3 R14.1
Net-(CN1-4): CN1.4 R15.1
Net-(CN2-4): CN2.4 U4.2
Net-(D4-1): D4.1(K) Q1.4(G) R8.1
Net-(LEDB1-2): LEDB1.2(C) R18.2
Net-(LEDG1-2): LEDG1.2(C) R11.2
Net-(Q2-4): Q2.4(G) Q3.3 R10.1
Net-(Q3-1): Q3.1 R12.2 R13.2
Net-(Q4-4): Q4.4(G) R25.2
Net-(Q4-8): Q4.8(D) RSNS1.2 RSS1N1.2
Net-(Q5-3): Q5.3(S) RSNS2.1 RSS2P1.2
Net-(Q5-4): Q5.4(G) R26.1
Net-(Q6-4): Q6.4(G) R27.2
Net-(Q7-4): Q7.4(G) R28.2
Net-(Q8-4): Q8.4(G) R35.2
Net-(Q8-8): Q8.8(D) RSNS3.2 RSS1N2.2
Net-(Q9-3): Q9.3(S) RSNS4.1 RSS2P2.2
Net-(Q9-4): Q9.4(G) R36.1
Net-(Q10-4): Q10.4(G) R37.2
Net-(Q11-4): Q11.4(G) R38.2
Net-(R1-1): R1.1 R4.2 U1.5(FB)
Net-(R3-1): R3.1 R6.2 U1.3(EN)
Net-(R7-2): R7.2 U1.4(RT/CLK)
Net-(R25-1): R25.1 U7.28(HD1)
Net-(R26-2): R26.2 U7.21(HD2)
Net-(R27-1): R27.1 U7.26(LD1)
Net-(R28-1): R28.1 U7.23(LD2)
Net-(R32-2): R32.2 U7.8(DT)
Net-(R33-2): R33.2 U7.15(COMP)
Net-(R34-2): R34.2 U7.10(FREQ)
Net-(R35-1): R35.1 U8.28(HD1)
Net-(R36-2): R36.2 U8.21(HD2)
Net-(R37-1): R37.1 U8.26(LD1)
Net-(R38-1): R38.1 U8.23(LD2)
Net-(R42-2): R42.2 U8.8(DT)
Net-(R45-2): R45.2 U8.15(COMP)
Net-(R46-2): R46.2 U8.10(FREQ)
Net-(RDOWN1-2): RDOWN1.2 RUP1.1 U7.16(FB)
Net-(RDOWN2-2): RDOWN2.2 RUP2.1 U8.16(FB)
Net-(RILIM1-1): RILIM1.1 U7.6(ITUNE)
Net-(RILIM4-1): RILIM4.1 U8.6(ITUNE)

Not connected (* = marked no-connect by the designer): U2 4(NC)*; U5 1(VBAT)* 2(PC13-TAMPER-RTC)* 12(PA2)* 14(PA4)* 15(PA5)* 20(PB2)* 38(PA15)* 39(PB3)* 40(PB4)* 41(PB5)* 42(PB6)* 43(PB7)* 45(PB8)* 46(PB9)*; U7 2(NC)* 7(NC)* 9(NC)* 13(NC)*; U8 2(NC)* 7(NC)* 9(NC)* 13(NC)*

## Notes on the sheets
sheet 1
- 电容分先后
- 电容分先后
- 差分走线
- C46
- POWER
- 旁路电容靠近管脚
- 差分走线，不包含功率路径
- 输出电压26.015V
- 输出电压25.41V,if RUP=20K
- 环路补偿
- 输入限流12.1A
sheet 2
- 电容分先后
- 电容分先后
- C64
- 差分走线
- POWER
- 旁路电容靠近管脚
- 差分走线，不包含功率路径
- 输出电压26.015V
- 输出电压25.41V,if RUP=20K
- 环路补偿
- 输出限流19.868A
sheet 6
- IMAX=250mA
